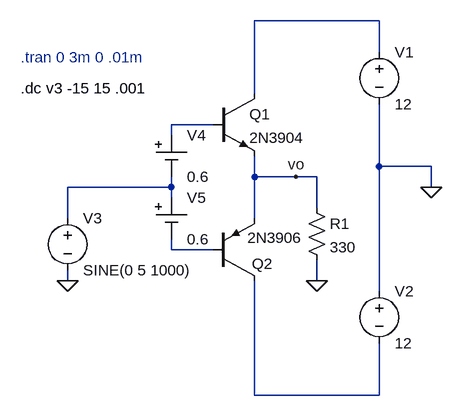
[diagram p0: schematic teoria5.asc]
teoria5.asc, the LTspice schematic file:
Version 4
SHEET 1 1092 680
WIRE 448 -32 256 -32
WIRE 448 16 448 -32
WIRE 256 80 256 -32
WIRE 192 128 128 128
WIRE 128 144 128 128
WIRE 448 192 448 96
WIRE 528 192 448 192
WIRE 256 208 256 176
WIRE 320 208 256 208
WIRE 352 208 320 208
WIRE 128 224 128 208
WIRE 128 224 -32 224
WIRE 528 224 528 192
WIRE 128 240 128 224
WIRE 352 256 352 208
WIRE -32 272 -32 224
WIRE 256 272 256 208
WIRE 128 320 128 304
WIRE 192 320 128 320
WIRE -32 368 -32 352
WIRE 352 368 352 336
WIRE 448 384 448 192
WIRE 256 544 256 368
WIRE 448 544 448 464
WIRE 448 544 256 544
FLAG 352 368 0
FLAG 528 224 0
FLAG 320 208 vo
FLAG -32 368 0
SYMBOL npn 192 80 R0
SYMATTR InstName Q1
SYMATTR Value 2N3904
SYMBOL pnp 192 368 M180
WINDOW 0 60 26 Left 2
WINDOW 3 53 66 Left 2
SYMATTR InstName Q2
SYMATTR Value 2N3906
SYMBOL voltage 448 0 R0
WINDOW 123 0 0 Left 0
WINDOW 39 0 0 Left 0
SYMATTR InstName V1
SYMATTR Value 12
SYMBOL voltage 448 368 R0
WINDOW 123 0 0 Left 0
WINDOW 39 0 0 Left 0
SYMATTR InstName V2
SYMATTR Value 12
SYMBOL res 336 240 R0
SYMATTR InstName R1
SYMATTR Value 330
SYMBOL voltage -32 256 R0
WINDOW 123 0 0 Left 0
WINDOW 39 0 0 Left 0
SYMATTR InstName V3
SYMATTR Value SINE(0 5 1000)
SYMBOL Misc\\cell 128 144 R0
WINDOW 123 0 0 Left 0
WINDOW 39 0 0 Left 0
SYMATTR InstName V4
SYMATTR Value 0.6
SYMBOL Misc\\cell 128 240 R0
WINDOW 123 0 0 Left 0
WINDOW 39 0 0 Left 0
SYMATTR InstName V5
SYMATTR Value 0.6
TEXT -104 24 Left 2 ;.tran 0 3m 0 .01m
TEXT -104 72 Left 2 !.dc v3 -15 15 .001

The netlist it stands for:
* teoria5.asc
Q1 N001 N002 vo 0 2N3904
Q2 N005 N004 vo 0 2N3906
V1 N001 0 12
V2 0 N005 12
R1 vo 0 330
V3 N003 0 SINE(0 5 1000)
V4 N002 N003 0.6
V5 N003 N004 0.6
.model NPN NPN
.model PNP PNP
.lib standard.bjt
* .tran 0 3m 0 .01m
.dc v3 -15 15 .001
.backanno
.end